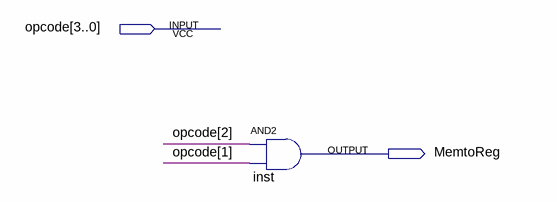
[diagram p0: schematic sheet]
// Quartus schematic MtoReg.bdf as structural Verilog: 1 symbols, 2 pins
module MtoReg (
  input  [3:0] opcode,
  output MemtoReg
);

  and inst (MemtoReg, opcode[2], opcode[1]);
endmodule
